# Altium schematic sheet MCISO-S07-V00-CANMain.SchDoc: Isolated CANBUS2 3V3
size A3; DrawnBy: Jonn Dillon; DocumentNumber: 5; Revision: 01; SheetNumber: 4; SheetTotal: 9; Version: 01; Project: AMU 2020 (Sourced from BMS 2020); PageSetup: Record=PageOptions|CenterHorizontal=True|CenterVertical=True|PrintScale=0.97|XCorrection=1.00|YCorrection=1.00|PrintKind=0|BorderSize=5000000|LeftOffset=0|BottomOffset=0|Orientation=2|PaperLength=1000|PaperWidth=1000|Scale=100|PaperSource=7|PrintQuality=-4|MediaType=1|DitherType=10|PaperKind=A4|PrintScaleMode=1
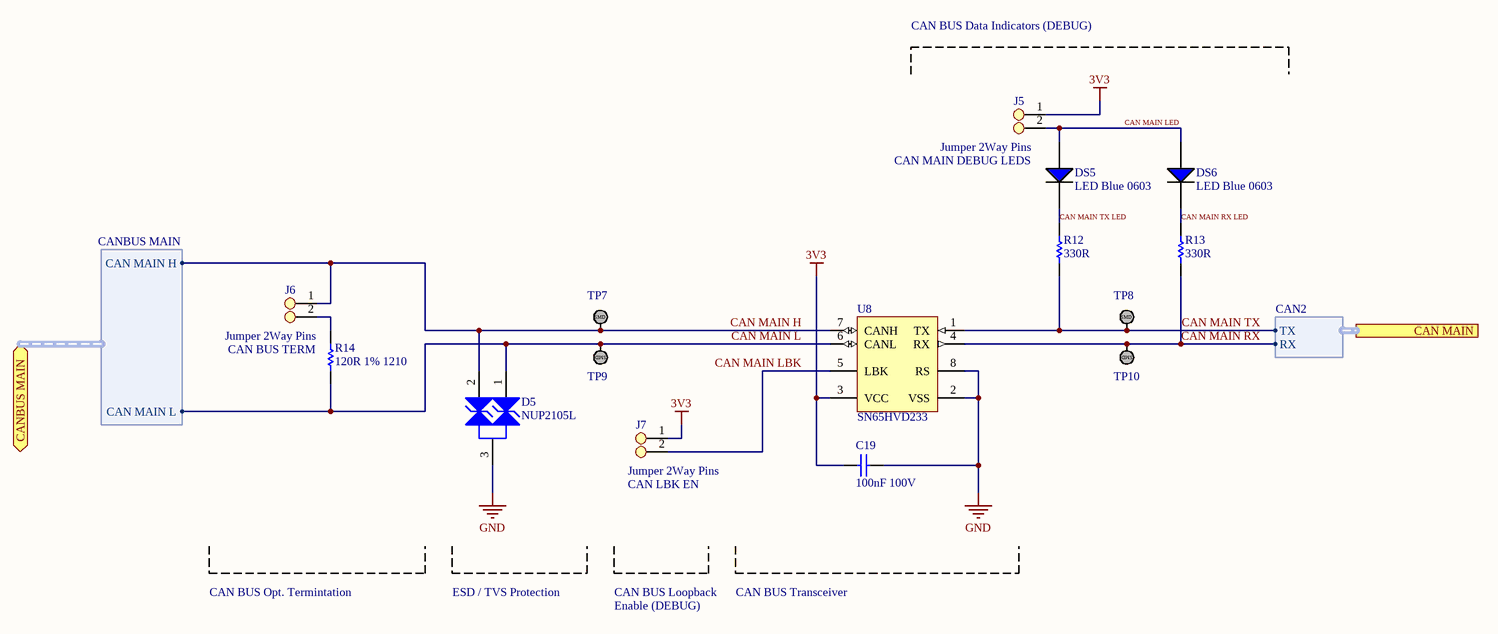
[diagram p0: MCISO-S07-V00-CANMain.SchDoc]

## Parts
C19  100nF 100V  [Cap_Ceramic_0603]
D5  NUP2105L  [NUP2105L]
DS5  LED Blue 0603  [LED BLUE 0603]
DS6  LED Blue 0603  [LED BLUE 0603]
J5  Jumper 2Way Pins  [Jumper_2Way_Pin]
J6  Jumper 2Way Pins  [Jumper_2Way_Pin]
J7  Jumper 2Way Pins  [Jumper_2Way_Pin]
R12  330R  [Res_ThinFilm_0603]
R13  330R  [Res_ThinFilm_0603]
R14  120R 1% 1210  [Res_ThinFilm_1210]
TP7  TestPoint_SMD  [TestPointSMD]  (value not drawn)
TP8  TestPoint_SMD  [TestPointSMD]  (value not drawn)
TP9  TestPoint_SMD  [TestPointSMD]  (value not drawn)
TP10  TestPoint_SMD  [TestPointSMD]  (value not drawn)
U8  SN65HVD233  [SN65HVD233DR]

## Ports
CAN MAIN (harness CAN2), CANBUS MAIN (bidir, harness CANBUS MAIN)

## Harnesses
CANBUS MAIN: CAN MAIN H, CAN MAIN L
CAN2: RX, TX

## Nets
3V3: C19.2 J5.1 J7.1 U8.3(VCC)
GND: C19.1 D5.3 U8.2(VSS) U8.8(RS)
CAN MAIN H: D5.2 J6.1 TP7.1 U8.7(CANH) ; port CANBUS MAIN.CAN MAIN H
CAN MAIN L: D5.1 R14.1 TP9.1 U8.6(CANL) ; port CANBUS MAIN.CAN MAIN L
CAN MAIN LBK: J7.2 U8.5(LBK)
CAN MAIN LED: DS5.1(A) DS6.1(A) J5.2
CAN MAIN RX: R13.1 TP10.1 U8.4(RX) ; port CAN MAIN.RX
CAN MAIN RX LED: DS6.2(C) R13.2
CAN MAIN TX: R12.1 TP8.1 U8.1(TX) ; port CAN MAIN.TX
CAN MAIN TX LED: DS5.2(C) R12.2
NetJ6_2: J6.2 R14.2

## Notes on the sheet
- CAN BUS Data Indicators (DEBUG)
- CAN MAIN DEBUG LEDS
- (near R14) CAN BUS TERM
- (near J7) CAN LBK EN
- CAN BUS Opt. Termintation
- ESD / TVS Protection
- CAN BUS Loopback
- Enable (DEBUG)
- CAN BUS Transceiver
- Revision History:
- Sheet Title:
- Rev
- Date
- Description
- Project:
- Size:
- Drawn By:
- A3
- Number:
- Revision:
- Sheet
- Version:
- of
- QUT Motorsport
- O-120, Gardens Point
- 2 George Street
- Brisbane, QLD 4000
- Australia
- Print Date:
- Print Time:
- File Name:
- (in symbol TestPoint_SMD) SMD

## Library data of the parts
C19 = 100nF 100V 5% X7R 0603: Capacitor, Ceramic, SMD, 100nF, 100V, 5%, X7R, 0603
J5-J7 = Jumper 2Way Side Pins
R12 R13 = 330R 5% 0603: Resistor, SMD, 330R, 0.1W, 5%, 0603
R14 = 120R 1% 1210: Resistor, SMD, 120R, 0.25W, 1%, 1210
D5 = NUP2105L: ComponentLink1Description: Datasheet; ComponentLink1URL: https://www.onsemi.cn/PowerSolutions/document/NUP2105L-D.PDF; Parameter 1: *; ComponentLink2Description: LCSC; ComponentLink2URL: https://lcsc.com/product-detail/TVS_ON-Semiconductor-NUP2105LT1G_C14486.html; ComponentLink3Description: Digikey; ComponentLink3URL: https://www.digikey.com.au/product-detail/en/on-semiconductor/SZNUP2105LT1G/SZNUP2105LT1GOSCT-ND/3487669
U8 = SN65HVD233: ComponentLink1Description: LCSC; ComponentLink1URL: https://lcsc.com/product-detail/CAN-ICs_Texas-Instruments_SN65HVD233DRG4_Texas-Instruments-Texas-Instruments-SN65HVD233DRG4_C61643.html; ComponentLink2Description: Digikey; ComponentLink2URL: https://www.digikey.com.au/product-detail/en/texas-instruments/SN65HVD233DR/296-35967-1-ND/4134960; ComponentLink3Description: Datasheet; ComponentLink3URL: https://www.ti.com/lit/ds/symlink/sn65hvd233.pdf?ts=1588560888178; ComponentLink4Description: Ti Product Page; ComponentLink4URL: https://www.ti.com/product/SN65HVD233